# Altium schematic sheet uController_and_communication.SchDoc
size A3; SheetNumber: 1; SheetTotal: 2
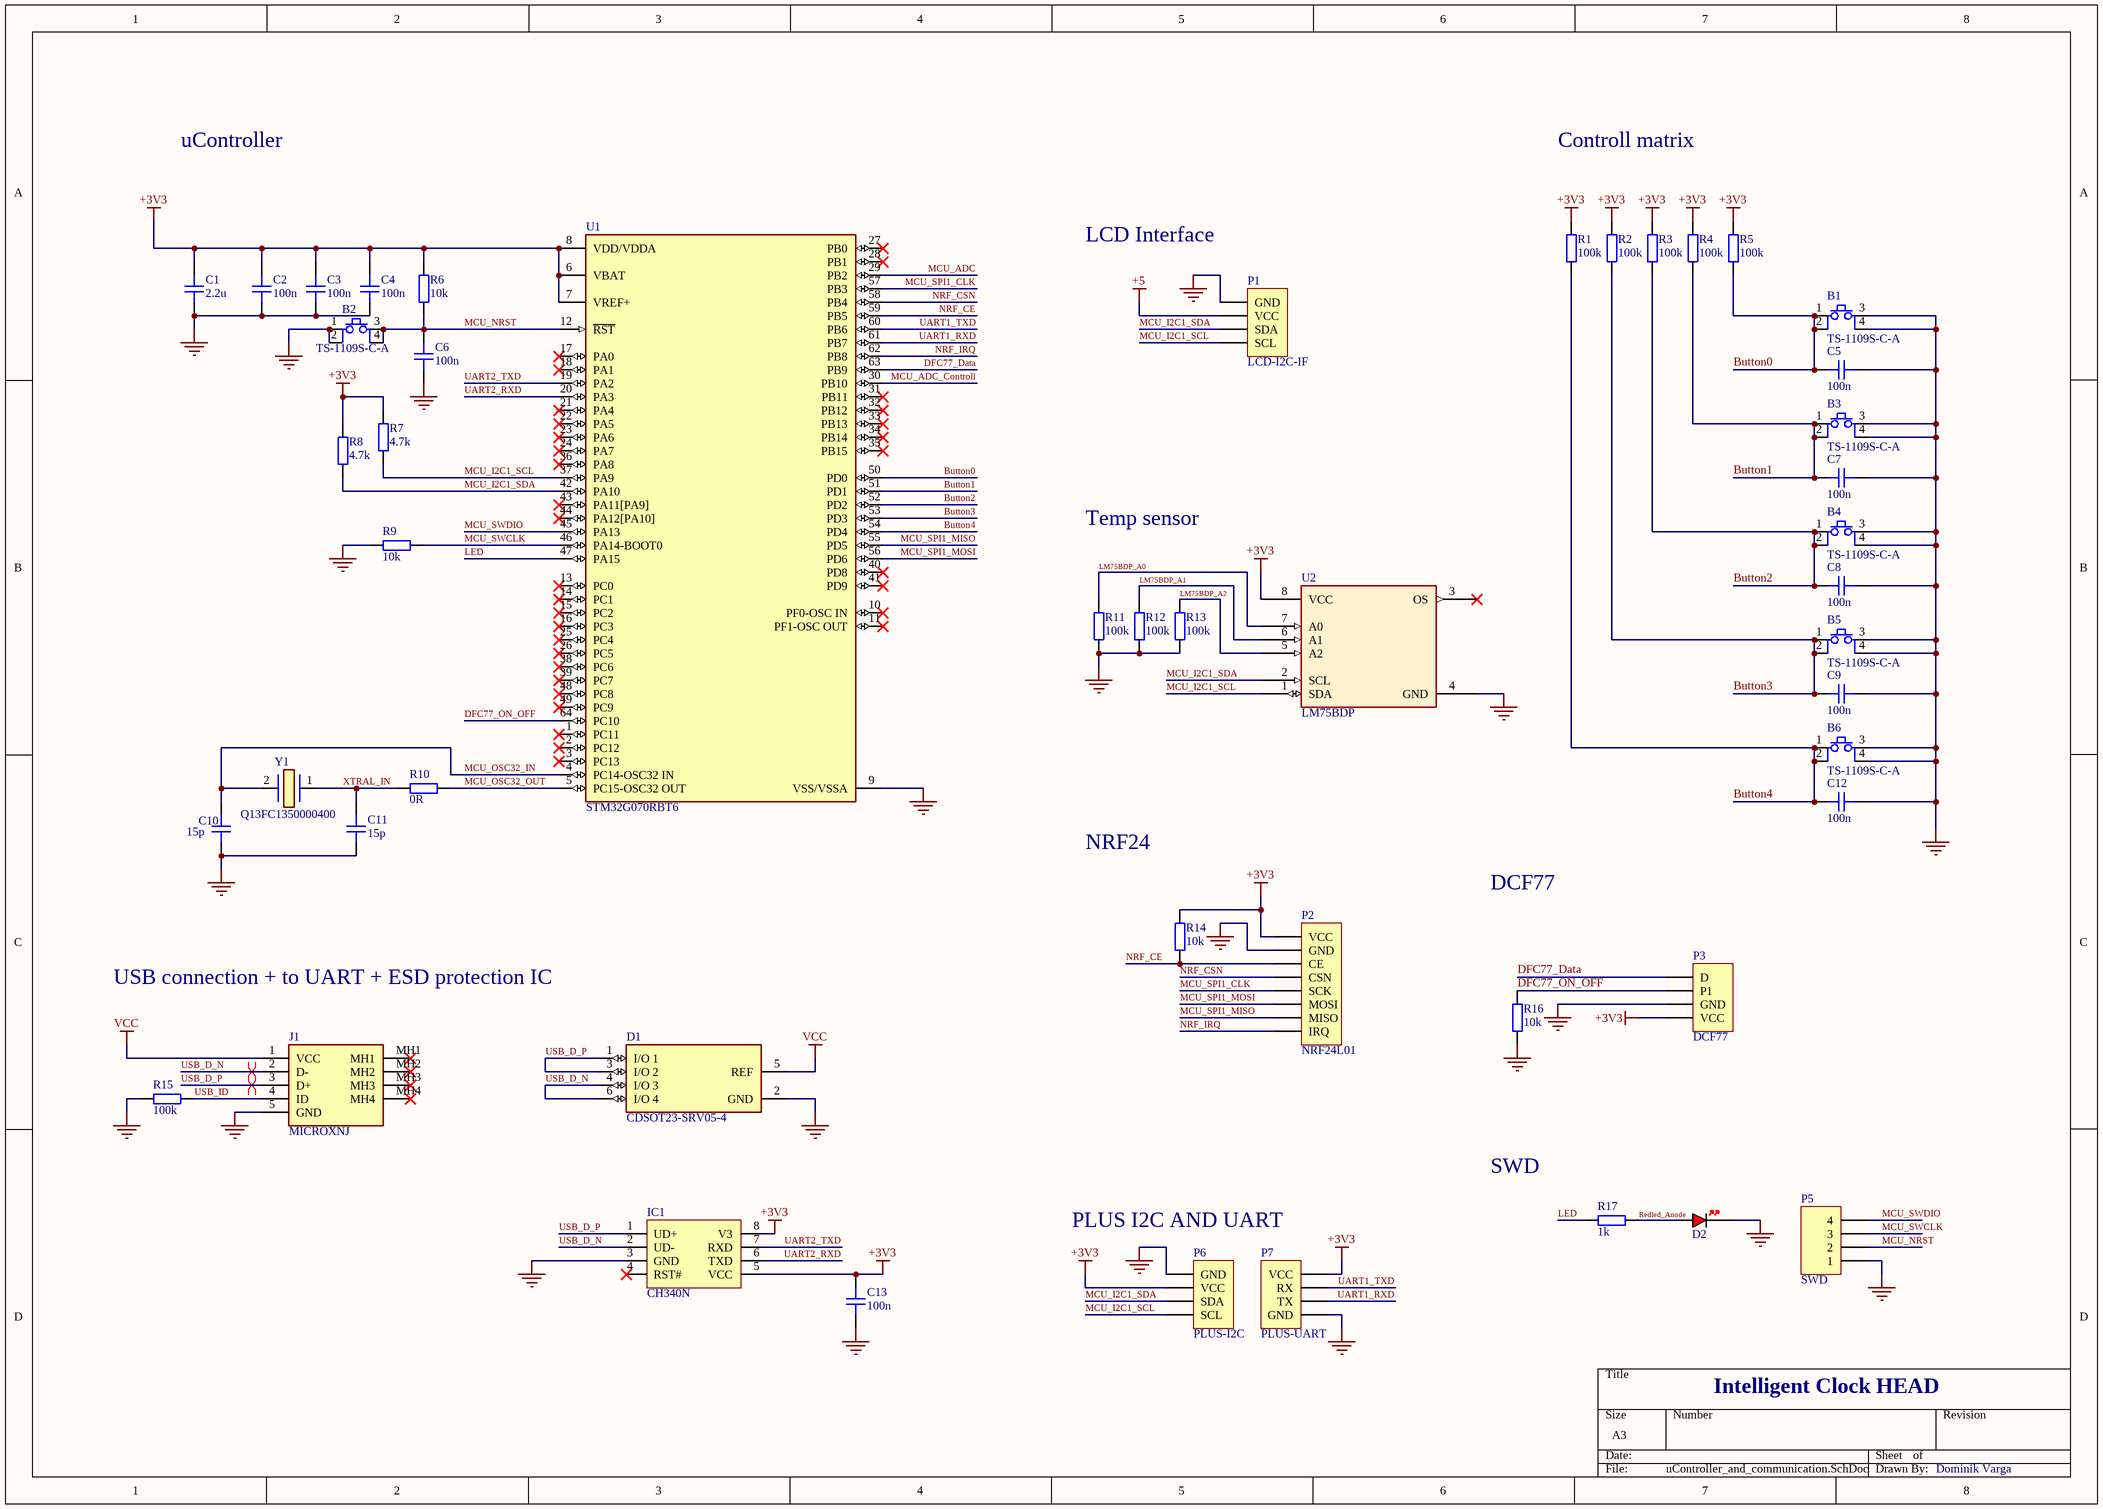
[diagram p0: uController_and_communication.SchDoc]

## Parts
B1  TS-1109S-C-A  [SMD_Button]
B2  TS-1109S-C-A  [SMD_Button]
B3  TS-1109S-C-A  [SMD_Button]
B4  TS-1109S-C-A  [SMD_Button]
B5  TS-1109S-C-A  [SMD_Button]
B6  TS-1109S-C-A  [SMD_Button]
C1  2.2u  [CAP_0603]
C2  100n  [CAP_0603]
C3  100n  [CAP_0603]
C4  100n  [CAP_0603]
C5  100n  [CAP_0603]
C6  100n  [CAP_0603]
C7  100n  [CAP_0603]
C8  100n  [CAP_0603]
C9  100n  [CAP_0603]
C10  15p  [CAP_0603]
C11  15p  [CAP_0603]
C12  100n  [CAP_0603]
C13  100n  [CAP_0603]
D1  CDSOT23-SRV05-4  [FP-CDSOT23-SRV05-4-MFG]
D2  RED  [LED_0603_RED]  (value not drawn)
IC1  CH340N  [SOP127P600X190-8N]
J1  MICROXNJ  [MICROXNJ]
P1  LCD-I2C-IF  [HDR1X4]
P2  NRF24L01  [MHDR1X8]
P3  DCF77  [HDR1X4]
P5  SWD  [HDR1X4]
P6  PLUS-I2C  [HDR1X4]
P7  PLUS-UART  [HDR1X4]
R1  100k  [RES_0603]
R2  100k  [RES_0603]
R3  100k  [RES_0603]
R4  100k  [RES_0603]
R5  100k  [RES_0603]
R6  10k  [RES_0603]
R7  4.7k  [RES_0603]
R8  4.7k  [RES_0603]
R9  10k  [RES_0603]
R10  0R  [RES_0603]
R11  100k  [RES_0603]
R12  100k  [RES_0603]
R13  100k  [RES_0603]
R14  10k  [RES_0603]
R15  100k  [RES_0603]
R16  10k  [RES_0603]
R17  1k  [RES_0603]
U1  STM32G070RBT6  [FP-LQFP64-5W-MFG]
U2  LM75BDP  [TSSOP8_3P1X3P1_NXP-M]
Y1  Q13FC1350000400  [Q13FC1350000400]

## Nets
+3V3: C1.2 C2.2 C3.2 C4.2 C13.2 IC1.5(VCC) IC1.8(V3) P2.1(VCC) P3.4(VCC) P6.2(VCC) P7.4(VCC) R1.2 R2.2 R3.2 R4.2 R5.2 R6.2 R7.1 R8.1 R14.1 U1.6(VBAT) U1.7(VREF+) U1.8(VDD/VDDA) U2.8(VCC)
+5: P1.2(VCC)
GND: B1.3 B1.4 B2.1 B2.2 B3.3 B3.4 B4.3 B4.4 B5.3 B5.4 B6.3 B6.4 C1.1 C2.1 C3.1 C4.1 C5.2 C6.1 C7.2 C8.2 C9.2 C10.1 C11.1 C12.2 C13.1 D1.2(GND) D2.K IC1.3(GND) J1.5(GND) P1.1(GND) P2.2(GND) P3.3(GND) P5.1 P6.1(GND) P7.1(GND) R9.2 R11.2 R12.2 R13.2 R15.2 R16.2 U1.9(VSS/VSSA) U2.4(GND)
VCC: D1.5(REF) J1.1(VCC)
Button0: B1.1 B1.2 C5.1 R5.1 U1.50(PD0)
Button1: B3.1 B3.2 C7.1 R4.1 U1.51(PD1)
Button2: B4.1 B4.2 C8.1 R3.1 U1.52(PD2)
Button3: B5.1 B5.2 C9.1 R2.1 U1.53(PD3)
Button4: B6.1 B6.2 C12.1 R1.1 U1.54(PD4)
DFC77_Data: P3.1(D) U1.63(PB9)
DFC77_ON_OFF: P3.2(P1) R16.1 U1.64(PC10)
LED: R17.2 U1.47(PA15)
LM75BDP_A0: R11.1 U2.7(A0)
LM75BDP_A1: R12.1 U2.6(A1)
LM75BDP_A2: R13.1 U2.5(A2)
MCU_ADC: U1.29(PB2)
MCU_ADC_Controll: U1.30(PB10)
MCU_I2C1_SCL: P1.4(SCL) P6.4(SCL) R7.2 U1.37(PA9) U2.1(SDA)
MCU_I2C1_SDA: P1.3(SDA) P6.3(SDA) R8.2 U1.42(PA10) U2.2(SCL)
MCU_NRST: B2.3 B2.4 C6.2 P5.2 R6.1 U1.12(~{RST})
MCU_OSC32_IN: C10.2 U1.4(PC14-OSC32_IN) Y1.2(CRYSTAL_2)
MCU_OSC32_OUT: R10.1 U1.5(PC15-OSC32_OUT)
MCU_SPI1_CLK: P2.5(SCK) U1.57(PB3)
MCU_SPI1_MISO: P2.7(MISO) U1.55(PD5)
MCU_SPI1_MOSI: P2.6(MOSI) U1.56(PD6)
MCU_SWCLK: P5.3 R9.1 U1.46(PA14-BOOT0)
MCU_SWDIO: P5.4 U1.45(PA13)
NRF_CE: P2.3(CE) R14.2 U1.59(PB5)
NRF_CSN: P2.4(CSN) U1.58(PB4)
NRF_IRQ: P2.8(IRQ) U1.62(PB8)
Redled_Anode: D2.A R17.1
UART1_RXD: P7.2(TX) U1.61(PB7)
UART1_TXD: P7.3(RX) U1.60(PB6)
UART2_RXD: IC1.6(TXD) U1.20(PA3)
UART2_TXD: IC1.7(RXD) U1.19(PA2)
USB_D_N: D1.4(I/O_3) D1.6(I/O_4) IC1.2(UD-) J1.2(D-)
USB_D_P: D1.1(I/O_1) D1.3(I/O_2) IC1.1(UD+) J1.3(D+)
USB_ID: J1.4(ID) R15.1
XTRAL_IN: C11.2 R10.2 Y1.1

Not connected (* = marked no-connect by the designer): IC1 4(RST#)*; J1 MH1* MH2* MH3* MH4*; U1 1(PC11)* 2(PC12)* 3(PC13)* 10(PF0-OSC_IN)* 11(PF1-OSC_OUT)* 13(PC0)* 14(PC1)* 15(PC2)* 16(PC3)* 17(PA0)* 18(PA1)* 21(PA4)* 22(PA5)* 23(PA6)* 24(PA7)* 25(PC4)* 26(PC5)* 27(PB0)* 28(PB1)* 31(PB11)* 32(PB12)* 33(PB13)* 34(PB14)* 35(PB15)* 36(PA8)* 38(PC6)* 39(PC7)* 40(PD8)* 41(PD9)* 43(PA11[PA9])* 44(PA12[PA10])* 48(PC8)* 49(PC9)*; U2 3(OS)*

## Layout directives
differential pair; differential pair class DIFF_USB: USB_D_N, USB_D_P

## Notes on the sheet
- uController
- Controll matrix
- LCD Interface
- (near C1) VREF+ reference voltage for ADC
  more sensitive?
  Apply filer ferralbeat, small conductor
- bulk De-coupling CAP
- Coupling Capacitors
- Temp sensor
- (near R10) Do not place resistor
  32.768kHz - 10-25Mohm
- NRF24
- DCF77
- USB connection + to UART + ESD protection IC
- SWD
- PLUS I2C AND UART
- Intelligent Clock HEAD
- Dominik Varga

## Library data of the parts
B1-B6 = TS-1109S-C-A: Basic SMD button; Manufacturer: XKB Connectivity; Manufacturer Part Number: TS-1109S-C-A; Datasheet: https://datasheet.lcsc.com/lcsc/2110151730_XKB-Connectivity-TS-1109S-C-A_C397346.pdf
C1-C13 = CAP_0603_10V: Capacitor SMD 0603 10V
D1 = CMP-07401-000007-1: TVS DIODE 5V 15V SOT23-6; Manufacturer: Bourns Inc.; Standoff Height: 0.2mm; Direction: Bidirectional; Peak Pulse Power: 500W; Max Junction Temp: +150°C; Number Of Channels: 4; Breakdown Voltage: 6V; Peak Pulse Current: 30A; Temperature Range High: +150°C; RoHS: TRUE; Category: Diode; Clamping Voltage: 15V; Reverse Standoff Voltage: 5V; Manufacturer Part Number: CDSOT23-SRV05-4; Octopart: https://octopart.com/cdsot23-srv05-4-bourns-1679449; Automotive: No; ComponentLink2URL: https://www.bourns.com/docs/Product-Datasheets/CDSOT23-SRV05-4.pdf; Device Class L1: Circuit Protection; Temperature: -55°C to +150°C; Device Class L2: TVS Diodes; Temperature Range Low: -55°C; Lead Free: Yes; Device Class L3: unset; Height: 1.45mm; Package: CDSOT23-SRV05-4; Ipc Land Pattern Name: SOT95P280X118-6; Mouser Description: CDSOT23-SRV05-4, Quad Uni-Directional TVS Diode, 500W, 6-Pin SOT-23; ComponentLink2Description: Datasheet; Digikey Description: TVS DIODE 5V 15V SOT23-6
D2 = LED_0603_RED: LED 0603 RED SMD
IC1 = CH340N: USB to UART integrated circuit; Manufacturer: WCH; Manufacturer part number: CH340N; Datasheet: https://datasheet.lcsc.com/lcsc/2202231130_WCH-Jiangsu-Qin-Heng-CH340N_C2977777.pdf
J1 = MICROXNJ: Connector; Manufacturer_Name: Shou Han; Datasheet Link: https://datasheet.lcsc.com/szlcsc/1912111437_SHOU-HAN-MicroXNJ_C404969.pdf; Height: 2.425mm; Manufacturer_Part_Number: MICROXNJ
P1 P3 P5-P7 = Header 4: Header, 4-Pin; LatestRevisionDate: 17-Jul-2002; LatestRevisionNote: Re-released for DXP Platform.; Publisher: Altium Limited
P2 = MHDR1X8: Header, 8-Pin; LatestRevisionDate: 17-Jul-2002; LatestRevisionNote: Re-released for DXP Platform.; Publisher: Altium Limited
R1-R17 = RES_0603: Resistor SMD 0603
U1 = CMP-12105-000143-1: IC MCU 32BIT 128KB FLASH 64LQFP; RoHS Compliant: Yes
U2 = LM75BDP: No Description Available; Mfr_Name: NXP; Copyright: Copyright (C) 2022 Ultra Librarian. All rights reserved.; Manufacturer_Part_Number: LM75BDP; RefDes: RefDes; Type: DEV
Y1 = Q13FC1350000400: Crystal or Oscillator; Manufacturer_Name: Seiko Instruments Inc.; Datasheet Link: https://datasheet.lcsc.com/szlcsc/1901081604_Seiko-Epson-Q13FC1350000400_C32346.pdf; Height: 0.9mm; Manufacturer_Part_Number: Q13FC1350000400